# Altium project BrushlessDrive.PrjPcb
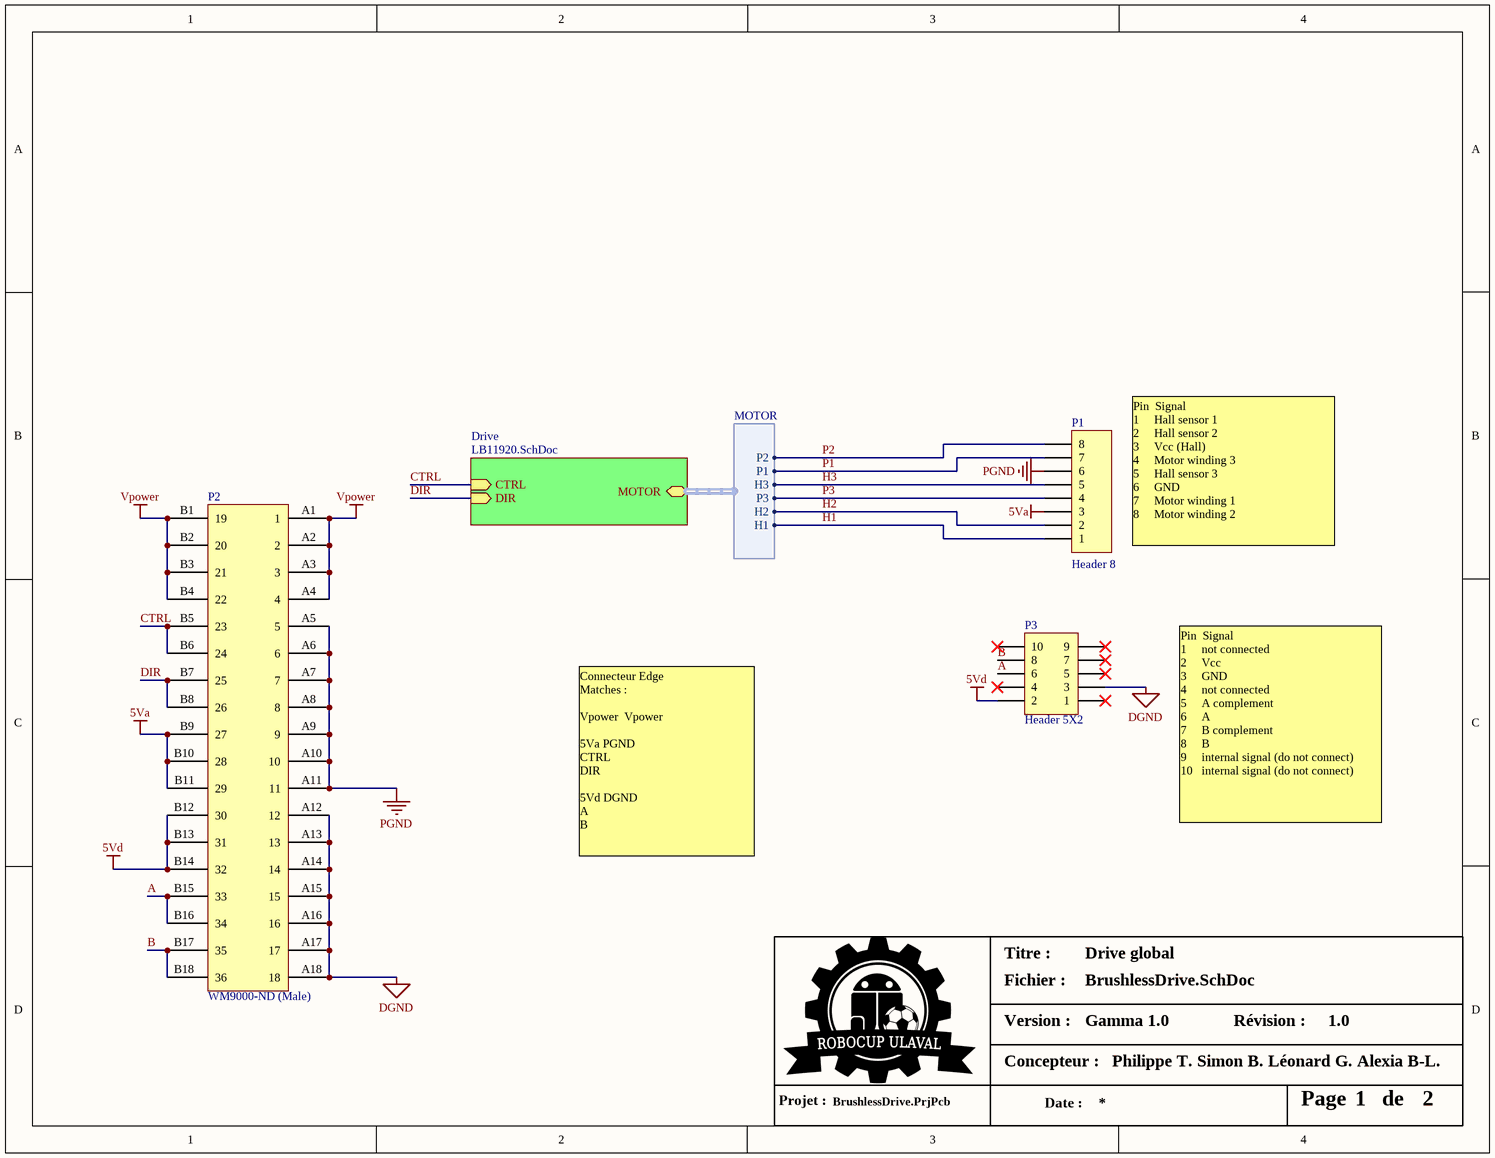
[diagram p0: BrushlessDrive.SchDoc]
2 sheets, 21 parts. Net scope: hierarchical (ports join the sheet entries above them; power ports are global).
Board file: PCB_BrushlessDrive.PcbDoc
Sheets:
  BrushlessDrive.SchDoc
    Drive = LB11920.SchDoc

## Sheet BrushlessDrive.SchDoc: Drive global
size Letter; Organization: Robocup Ulaval; DocumentNumber: 1; Revision: 1.0; SheetNumber: 1; SheetTotal: 2; Conceptor: Philippe T. Simon B. Léonard G. Alexia B-L.; Version: Gamma 1.0

### Parts
P1  Header 8  [HallSensor Connector]
P2  WM9000-ND (Male)  [Edge connector 36Pos]
P3  Header 5X2  [Encoder Connector]

### Sub-sheets
Drive = LB11920.SchDoc: MOTOR (harness MOTOR), CTRL (in), DIR (in)

### Harnesses
MOTOR: P1, P2, P3, H1, H2, H3

### Nets
5Va: P1.3 P2.B9(27) P2.B10(28) P2.B11(29)
5Vd: P2.B12(30) P2.B13(31) P2.B14(32) P3.2
DGND: P2.A12(12) P2.A13(13) P2.A14(14) P2.A15(15) P2.A16(16) P2.A17(17) P2.A18(18) P3.3
PGND: P1.6 P2.A5(5) P2.A6(6) P2.A7(7) P2.A8(8) P2.A9(9) P2.A10(10) P2.A11(11)
Vpower: P2.A1(1) P2.A2(2) P2.A3(3) P2.A4(4) P2.B1(19) P2.B2(20) P2.B3(21) P2.B4(22)
A: P2.B15(33) P2.B16(34) P3.6
B: P2.B17(35) P2.B18(36) P3.8
CTRL: P2.B5(23) P2.B6(24) ; sheet Drive/CTRL
DIR: P2.B7(25) P2.B8(26) ; sheet Drive/DIR
H1: P1.1 ; sheet Drive/MOTOR.H1
H2: P1.2 ; sheet Drive/MOTOR.H2
H3: P1.5 ; sheet Drive/MOTOR.H3
P1: P1.7 ; sheet Drive/MOTOR.P1
P2: P1.8 ; sheet Drive/MOTOR.P2
P3: P1.4 ; sheet Drive/MOTOR.P3

Not connected (* = marked no-connect by the designer): P3 1* 4* 5* 7* 9* 10*

### Notes on the sheet
- Pin  Signal
  1     Hall sensor 1
  2     Hall sensor 2
  3     Vcc (Hall)
  4     Motor winding 3
  5     Hall sensor 3
  6     GND
  7     Motor winding 1
  8     Motor winding 2
- Pin  Signal
  1     not connected
  2     Vcc
  3     GND
  4     not connected
  5     A complement
  6     A
  7     B complement
  8     B
  9     internal signal (do not connect)
  10   internal signal (do not connect)
- Connecteur Edge
  Matches :
  Vpower 	Vpower
  5Va	PGND
  CTRL
  DIR
  5Vd	DGND
  A
  B
- Titre :
- Version :
- Fichier :
- Révision :
- Projet :
- Concepteur :
- Date :
- Page
- de

### Library data of the parts
P1 = Header 8: Header, 8-Pin; LatestRevisionDate: 17-Jul-2002; LatestRevisionNote: Re-released for DXP Platform.; Publisher: Altium Limited
P3 = Header 5X2: Header, 5-Pin, Dual row; LatestRevisionDate: 17-Jul-2002; LatestRevisionNote: Re-released for DXP Platform.; Publisher: Altium Limited

## Sheet LB11920.SchDoc: Drive
size Letter; Organization: Robocup Ulaval; DocumentNumber: 2; Revision: 1.0; SheetNumber: 2; SheetTotal: 2; Conceptor: Philippe T. Simon B. Léonard G. Alexia B-L.; Version: Gamma 1.0
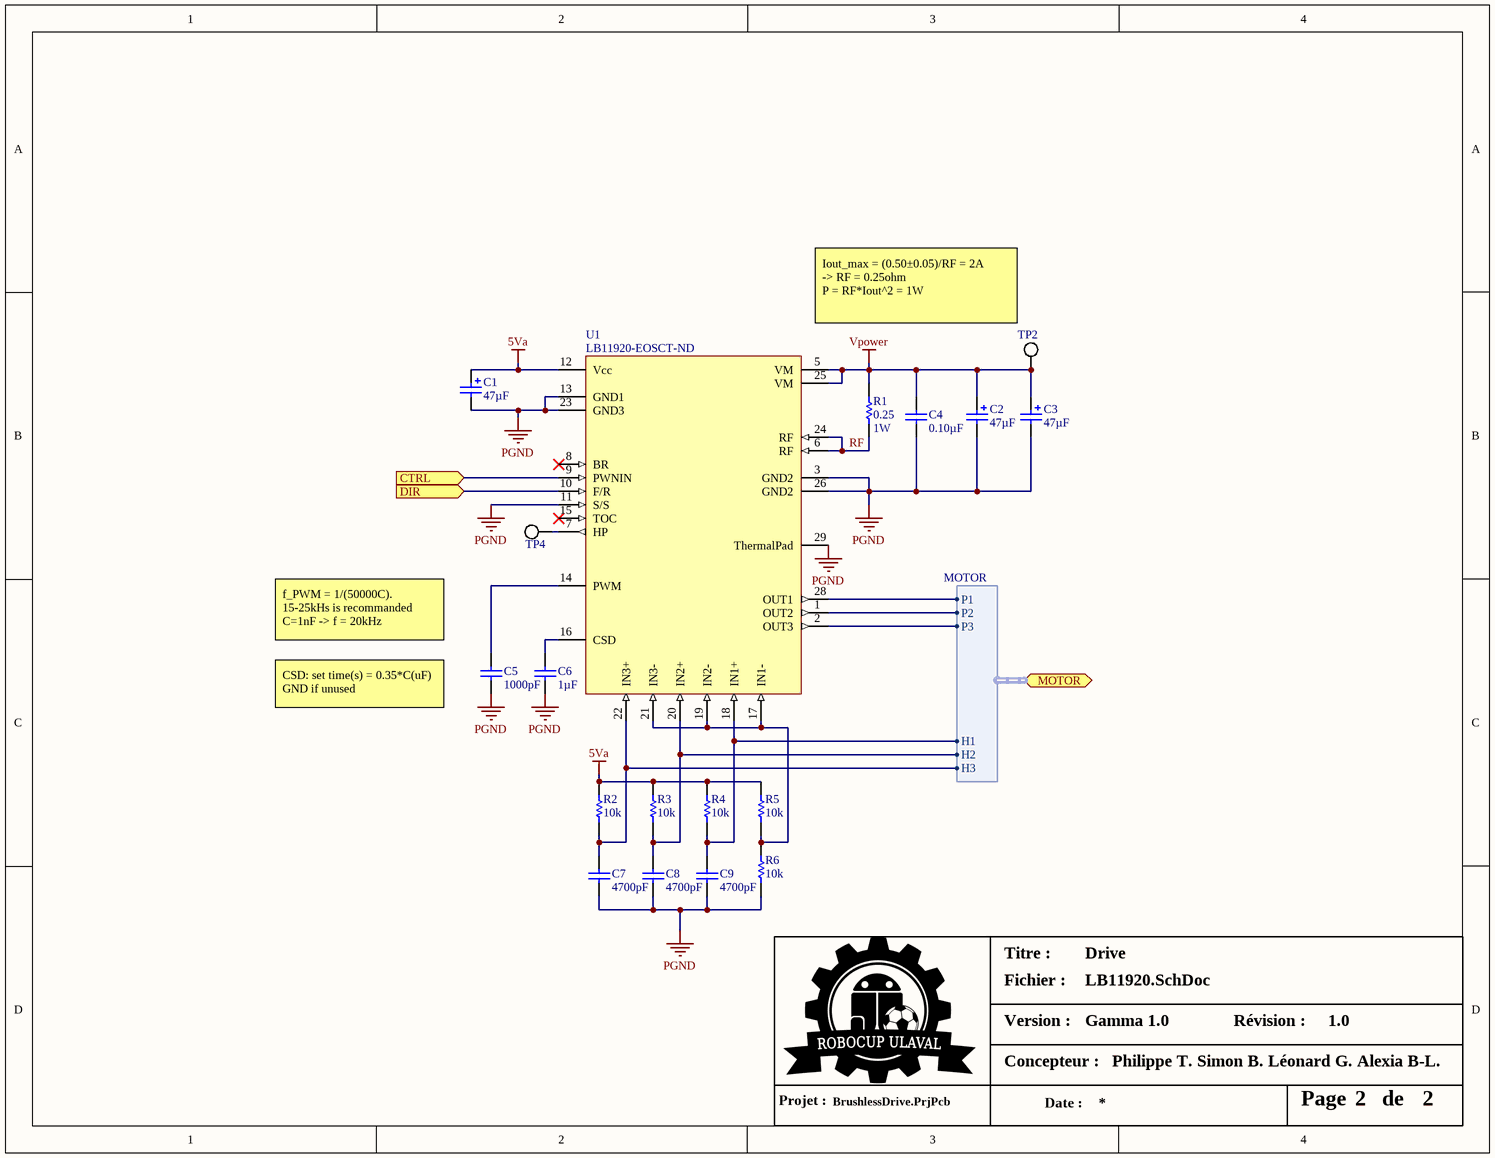
[diagram p1: LB11920.SchDoc]

### Parts
C1  Capacitance: 47µF  [CAP 6.6x6.6mm]  (hidden comment: 865080645012)
C2  Capacitance: 47µF  [CAP 6.6x6.6mm]  (hidden comment: 865080645012)
C3  Capacitance: 47µF  [CAP 6.6x6.6mm]  (hidden comment: 865080645012)
C4  Capacitance: 0.10µF  [0603]  (hidden comment: CL10B104KB8SFNC)
C5  Capacitance: 1000pF  [0603]  (hidden comment: CL10B102KB8NNNC)
C6  Capacitance: 1µF  [0805]  (hidden comment: CL21B105KBFNFNE)
C7  Capacitance: 4700pF  [0603]  (hidden comment: CL10B472KB8NNNC)
C8  Capacitance: 4700pF  [0603]  (hidden comment: CL10B472KB8NNNC)
C9  Capacitance: 4700pF  [0603]  (hidden comment: CL10B472KB8NNNC)
R1  Resistance (Ohms): 0.25  Power (Watts): 1W  [2010]  (hidden comment: CSRN2010FKR250)
R2  Resistance (Ohms): 10k  [0603]  (hidden comment: RC0603JR-0710KL)
R3  Resistance (Ohms): 10k  [0603]  (hidden comment: RC0603JR-0710KL)
R4  Resistance (Ohms): 10k  [0603]  (hidden comment: RC0603JR-0710KL)
R5  Resistance (Ohms): 10k  [0603]  (hidden comment: RC0603JR-0710KL)
R6  Resistance (Ohms): 10k  [0603]  (hidden comment: RC0603JR-0710KL)
TP2  testpoint  [0805 testpoint]  (value not drawn)
TP4  testpoint  [0805 testpoint]  (value not drawn)
U1  Supplier Part Number 1: LB11920-EOSCT-ND  [DIP28]  (hidden comment: LB11920-E)

### Ports
CTRL (in), DIR (in), MOTOR (harness MOTOR)

### Harnesses
MOTOR: P1, P2, P3, H1, H2, H3

### Nets
5Va: C1.1 R2.2 R3.2 R4.2 R5.2 U1.12(Vcc)
PGND: C1.2 C2.2 C3.2 C4.1 C5.1 C6.1 C7.1 C8.1 C9.1 R6.1 U1.3(GND2) U1.11(S/S) U1.13(GND1) U1.23(GND3) U1.26(GND2) U1.29(ThermalPad)
Vpower: C2.1 C3.1 C4.2 R1.2 TP2.1 U1.5(VM) U1.25(VM)
CTRL: U1.9(PWNIN) ; port CTRL
DIR: U1.10(F/R) ; port DIR
H1: C9.2 R4.1 U1.18(IN1+) ; port MOTOR.H1
H2: C8.2 R3.1 U1.20(IN2+) ; port MOTOR.H2
H3: C7.2 R2.1 U1.22(IN3+) ; port MOTOR.H3
P1: U1.28(OUT1) ; port MOTOR.P1
P2: U1.1(OUT2) ; port MOTOR.P2
P3: U1.2(OUT3) ; port MOTOR.P3
RF: R1.1 U1.6(RF) U1.24(RF)
NetC5_2: C5.2 U1.14(PWM)
NetC6_2: C6.2 U1.16(CSD)
NetR5_1: R5.1 R6.2 U1.17(IN1-) U1.19(IN2-) U1.21(IN3-)
NetTP4_1: TP4.1 U1.7(HP)

Not connected (* = marked no-connect by the designer): U1 8(BR)* 15(TOC)*

### Notes on the sheet
- Iout_max = (0.50±0.05)/RF = 2A
  -> RF = 0.25ohm
  P = RF*Iout^2 = 1W
- f_PWM = 1/(50000C).
  15-25kHs is recommanded
  C=1nF -> f = 20kHz
- (near C5) CSD: set time(s) = 0.35*C(uF)
  GND if unused
- Titre :
- Version :
- Fichier :
- Révision :
- Projet :
- Concepteur :
- Date :
- Page
- de

### Library data of the parts
C1-C3 = 865080645012: CAP 47 UF 20% 50 V; Manufacturer: Wurth Electronics Inc; Voltage Rating: 50V; Lifetime @ Temp.: 2000 Hrs @ 105°C; Polarization: Polar; Ripple Current: 230mA @ 100kHz; Impedance: 700 mOhm; Surface Mount Land Size: 0.260" L x 0.260" W (6.60mm x 6.60mm); Supplier 1: Digi-Key; Manufacturer Part Number: 865080645012; RoHS: RoHS Compliant; Category: Capacitors; Stock 1: 803; Pricing 1: 1=0.48, 50=0.4072, 100=0.3547, 250=0.31528 (CAD); Packaging: Cut Tape (CT); Tolerance: ±20%; ESR (Equivalent Series Resistance): -; Operating Temperature: -55°C ~ 105°C; Applications: General Purpose; Lead Spacing: -; Size / Dimension: 0.248" Dia (6.30mm); Height - Seated (Max): 0.303" (7.70mm); Mounting Type: Surface Mount; Package / Case: Radial, Can - SMD; ComponentLink1URL: http://katalog.we-online.de/pbs/datasheet/865080645012.pdf; ComponentLink1Description: http://katalog.we-online.de/pbs/datasheet/865080645012.pdf; Supplier Part Number 1: 732-8457-1-ND
C4 = CL10B104KB8SFNC: CAP CER 0.1UF 50V X7R 0603; Manufacturer: Samsung Electro-Mechanics America, Inc.; Tolerance: ±10%; Supplier 1: Digi-Key; Manufacturer Part Number: CL10B104KB8SFNC; RoHS: RoHS Compliant; Category: Capacitors; Stock 1: 2612665; Pricing 1: 1=0.14, 10=0.028, 25=0.0204, 50=0.0156, 100=0.0127, 250=0.01064, 500=0.00908, 1000=0.00712 (CAD); Packaging: Cut Tape (CT); Voltage - Rated: 50V; Temperature Coefficient: X7R; Mounting Type: Surface Mount, MLCC; Operating Temperature: -55°C ~ 125°C; Applications: Boardflex Sensitive; Ratings: -; Package / Case: 0603 (1608 Metric); Size / Dimension: 0.063" L x 0.031" W (1.60mm x 0.80mm); Height - Seated (Max): -; Thickness (Max): 0.035" (0.90mm); Lead Spacing: -; Features: Soft Termination; Lead Style: -; ComponentLink1URL: http://www.samsungsem.com/kr/support/product-search/mlcc/CL10B104KB8SFNC.jsp; ComponentLink1Description: http://www.samsungsem.com/kr/support/product-search/mlcc/CL10B104KB8SFNC.jsp; Supplier Part Number 1: 1276-1936-1-ND
C5 = CL10B102KB8NNNC: CAP CER 1000PF 50V X7R 0603; Manufacturer: Samsung Electro-Mechanics America, Inc.; Tolerance: ±10%; Supplier 1: Digi-Key; Manufacturer Part Number: CL10B102KB8NNNC; RoHS: RoHS Compliant; Category: Capacitors; Stock 1: 295372; Pricing 1: 1=0.14, 10=0.024, 25=0.0172, 50=0.013, 100=0.0109, 500=0.00768, 1000=0.00597 (CAD); Packaging: Cut Tape (CT); Voltage - Rated: 50V; Temperature Coefficient: X7R; Mounting Type: Surface Mount, MLCC; Operating Temperature: -55°C ~ 125°C; Applications: General Purpose; Ratings: -; Package / Case: 0603 (1608 Metric); Size / Dimension: 0.063" L x 0.031" W (1.60mm x 0.80mm); Height - Seated (Max): -; Thickness (Max): 0.035" (0.90mm); Lead Spacing: -; Features: -; Lead Style: -; ComponentLink1URL: http://www.samsungsem.com/kr/support/product-search/mlcc/CL10B102KB8NNNC.jsp; ComponentLink1Description: http://www.samsungsem.com/kr/support/product-search/mlcc/CL10B102KB8NNNC.jsp; Supplier Part Number 1: 1276-1018-1-ND
C6 = CL21B105KBFNFNE: CAP CER 1UF 50V X7R 0805; Manufacturer: Samsung Electro-Mechanics America, Inc.; Tolerance: ±10%; Supplier 1: Digi-Key; Manufacturer Part Number: CL21B105KBFNFNE; RoHS: RoHS Compliant; Stock 1: 21699; Pricing 1: 1=0.27, 10=0.186, 25=0.14, 50=0.1072, 100=0.0884, 500=0.06238, 1000=0.05123 (CAD); Packaging: Cut Tape (CT); Voltage - Rated: 50V; Temperature Coefficient: X7R; Mounting Type: Surface Mount, MLCC; Operating Temperature: -55°C ~ 125°C; Applications: General Purpose; Ratings: -; Package / Case: 0805 (2012 Metric); Size / Dimension: 0.079" L x 0.049" W (2.00mm x 1.25mm); Height - Seated (Max): -; Thickness (Max): 0.053" (1.35mm); Lead Spacing: -; Features: -; Lead Style: -; ComponentLink1URL: http://www.samsungsem.com/kr/support/product-search/mlcc/CL21B105KBFNFNE.jsp; ComponentLink1Description: http://www.samsungsem.com/kr/support/product-search/mlcc/CL21B105KBFNFNE.jsp; Supplier Part Number 1: 1276-2928-1-ND; Category: Capacitors
C7-C9 = CL10B472KB8NNNC: CAP CER 4700PF 50V X7R 0603; Manufacturer: Samsung Electro-Mechanics America, Inc.; Tolerance: ±10%; Supplier 1: Digi-Key; Manufacturer Part Number: CL10B472KB8NNNC; RoHS: RoHS Compliant; Category: Capacitors; Stock 1: 159154; Pricing 1: 1=0.14, 10=0.034, 25=0.0244, 50=0.0188, 100=0.0159, 500=0.01118, 1000=0.0087 (CAD); Packaging: Cut Tape (CT); Voltage - Rated: 50V; Temperature Coefficient: X7R; Mounting Type: Surface Mount, MLCC; Operating Temperature: -55°C ~ 125°C; Applications: General Purpose; Ratings: -; Package / Case: 0603 (1608 Metric); Size / Dimension: 0.063" L x 0.031" W (1.60mm x 0.80mm); Height - Seated (Max): -; Thickness (Max): 0.035" (0.90mm); Lead Spacing: -; Features: -; Lead Style: -; ComponentLink1URL: http://www.samsungsem.com/kr/support/product-search/mlcc/CL10B472KB8NNNC.jsp; ComponentLink1Description: http://www.samsungsem.com/kr/support/product-search/mlcc/CL10B472KB8NNNC.jsp; Supplier Part Number 1: 1276-1098-1-ND
R1 = CSRN2010FKR250: RES SMD 0.25 OHM 1% 1W 2010; Manufacturer: Stackpole Electronics Inc.; Temperature Coefficient: ±250ppm/°C; Supplier 1: Digi-Key; Manufacturer Part Number: CSRN2010FKR250; RoHS: RoHS Compliant; Category: Resistors; Stock 1: 35460; Pricing 1: 1=0.93, 10=0.662, 50=0.437, 100=0.3443, 250=0.29132, 500=0.23834 (CAD); Packaging: Cut Tape (CT); Part Status: Active; Tolerance: ±1%; Composition: Thick Film; Features: Current Sense; Operating Temperature: -55°C ~ 155°C; Package / Case: 2010 (5025 Metric); Supplier Device Package: 2010; Size / Dimension: 0.197" L x 0.097" W (5.00mm x 2.45mm); Height: 0.030" (0.75mm); Number of Terminations: 2; Failure Rate: -; ComponentLink1URL: http://www.seielect.com/catalog/SEI-CSR_CSRN.pdf; ComponentLink1Description: http://www.seielect.com/catalog/SEI-CSR_CSRN.pdf; Supplier Part Number 1: CSRN2010FKR250CT-ND
R2-R6 = RC0603JR-0710KL: RES SMD 10K OHM 5% 1/10W 0603; Manufacturer: Yageo; Power (Watts): 0.1W, 1/10W; Temperature Coefficient: ±100ppm/°C; Supplier 1: Digi-Key; Manufacturer Part Number: RC0603JR-0710KL; RoHS: RoHS Compliant; Category: Resistors; Stock 1: 5547866; Pricing 1: 1=0.15, 10=0.017, 25=0.012, 100=0.0067, 250=0.00508, 500=0.00408, 1000=0.003, 2500=0.0026 (CAD); Packaging: Cut Tape (CT); Tolerance: ±5%; Composition: Thick Film; Features: Moisture Resistant; Operating Temperature: -55°C ~ 155°C; Package / Case: 0603 (1608 Metric); Supplier Device Package: 0603; Size / Dimension: 0.063" L x 0.031" W (1.60mm x 0.80mm); Height: 0.022" (0.55mm); Number of Terminations: 2; ComponentLink1URL: http://www.yageo.com/documents/recent/PYu-RC_Group_51_RoHS_L_04.pdf; ComponentLink1Description: http://www.yageo.com/documents/recent/PYu-RC_Group_51_RoHS_L_04.pdf; Supplier Part Number 1: 311-10KGRCT-ND
U1 = LB11920-E: IC MOTOR DRIVER PAR 28HDIP; Manufacturer: ON Semiconductor; Motor Type - AC, DC: Brushless DC (BLDC); Function: Driver - Fully Integrated, Control and Power Stage; Output Configuration: Half Bridge (3); Interface: Parallel; Current - Output: 3.5A; Voltage - Supply: 4.5 V ~ 5.5 V; Voltage - Load: 9.5 V ~ 30 V; Supplier 1: Digi-Key; Manufacturer Part Number: LB11920-E; RoHS: RoHS Compliant; Category: Integrated Circuits (ICs); Stock 1: 65; Pricing 1: 1=10.11, 10=9.154 (CAD); Packaging: Cut Tape (CT); Motor Type - Stepper: -; Technology: Bipolar; Step Resolution: -; Applications: General Purpose; Operating Temperature: -20°C ~ 80°C (TA); Mounting Type: Through Hole; Package / Case: 28-SDIP (0.500", 12.70mm) Exposed Pad; Supplier Device Package: 28-DIP; ComponentLink1URL: http://www.onsemi.com/pub/Collateral/EN7229-D.PDF; ComponentLink1Description: http://www.onsemi.com/pub/Collateral/EN7229-D.PDF

## Nets that join several sheets
5Va: BrushlessDrive (P1.3 P2.B9 P2.B10 P2.B11), LB11920 (6 pins)
PGND: BrushlessDrive (8 pins), LB11920 (16 pins)
Vpower: BrushlessDrive (8 pins), LB11920 (7 pins)
CTRL: BrushlessDrive (P2.B5 P2.B6), LB11920 (U1.9)
DIR: BrushlessDrive (P2.B7 P2.B8), LB11920 (U1.10)
H1: BrushlessDrive (P1.1), LB11920 (C9.2 R4.1 U1.18)
H2: BrushlessDrive (P1.2), LB11920 (C8.2 R3.1 U1.20)
H3: BrushlessDrive (P1.5), LB11920 (C7.2 R2.1 U1.22)
P1: BrushlessDrive (P1.7), LB11920 (U1.28)
P2: BrushlessDrive (P1.8), LB11920 (U1.1)
P3: BrushlessDrive (P1.4), LB11920 (U1.2)